# Altium schematic sheet SD_CARD.SchDoc
size A4; DocumentNumber: 7; SheetNumber: 7; SheetTotal: 9
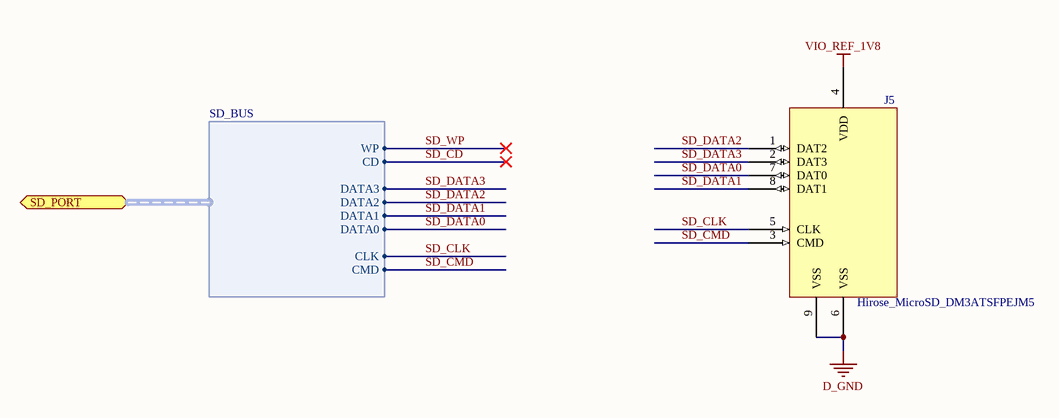
[diagram p0: SD_CARD.SchDoc]

## Parts
J5  Hirose_MicroSD_DM3ATSFPEJM5  [SD_Card_Hirose_DM3 AT_SF_PEJM5]

## Ports
SD_PORT (harness SD_BUS)

## Harnesses
SD_BUS: CMD, CLK, DATA0, DATA1, DATA2, DATA3, CD, WP

## Nets
D_GND: J5.6(VSS) J5.9(VSS)
VIO_REF_1V8: J5.4(VDD)
SD_CD: port SD_PORT.CD
SD_CLK: J5.5(CLK) ; port SD_PORT.CLK
SD_CMD: J5.3(CMD) ; port SD_PORT.CMD
SD_DATA0: J5.7(DAT0) ; port SD_PORT.DATA0
SD_DATA1: J5.8(DAT1) ; port SD_PORT.DATA1
SD_DATA2: J5.1(DAT2) ; port SD_PORT.DATA2
SD_DATA3: J5.2(DAT3) ; port SD_PORT.DATA3
SD_WP: port SD_PORT.WP

## Library data of the parts
J5 = Component_1